# EasyEDA Pro project MSU-avionics.eprj

# Schematic Schematic1
Create Date: 2024-06-27; Page Name: P1; Project Name: MSU-avionics; Schematic Name: Schematic1; Update Date: 2024-06-28; Company: EasyEDA.com; Drawn: EasyEDA; Page Size: A4; Part Number: JLCPCB-002; Reviewed: EasyEDA; Version: V0.1
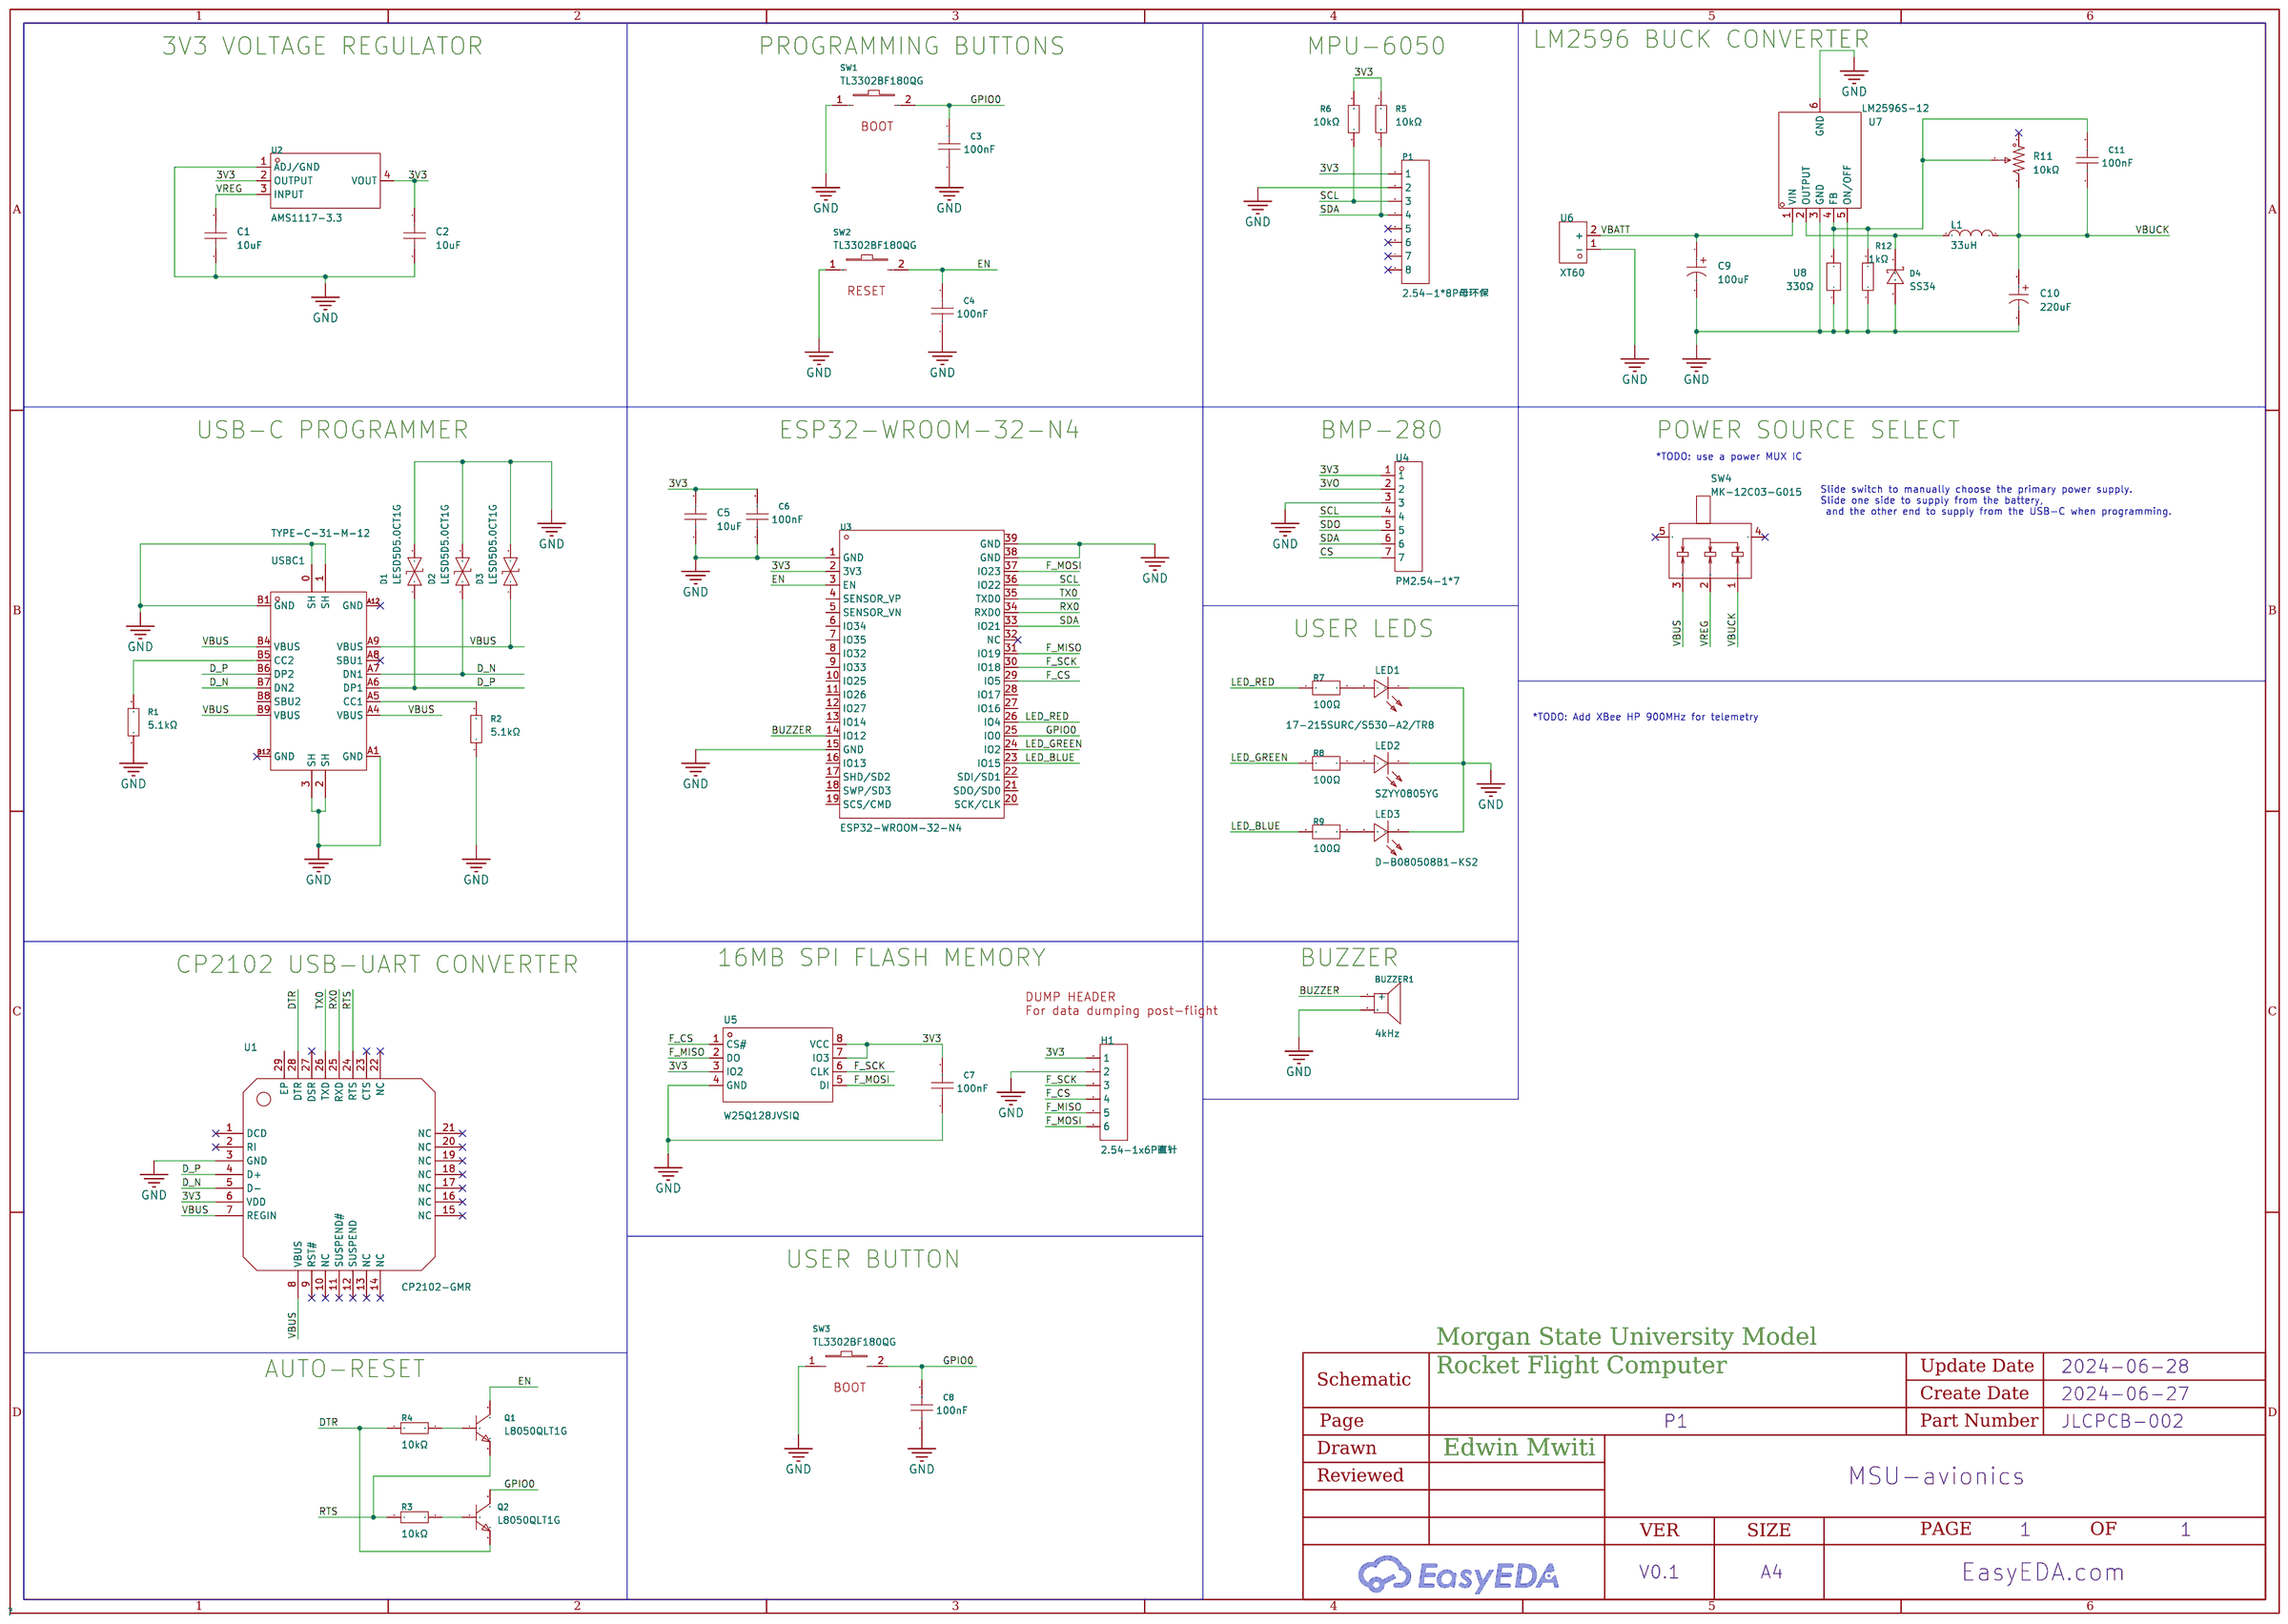
[diagram p0: schematic sheet]

## Parts
BUZZER1  4kHz  [BUZ-TH_BD14.0-P5.00-D0.7-FD]
C1  10uF  [C0805]
C2  10uF  [C0805]
C3  100nF  [C0805]
C4  100nF  [C0805]
C5  10uF  [C0805]
C6  100nF  [C0805]
C7  100nF  [C0805]
C8  100nF  [C0805]
C9  100uF  [CAP-SMD_BD6.3-L6.6-W6.6-LS7.2-FD]
C10  220uF  [CAP-SMD_BD10.0-L10.3-W10.3-FD]
C11  100nF  [C0805]
D1  LESD5D5.0CT1G  [SOD-523_L1.2-W0.8-LS1.6-BI]
D2  LESD5D5.0CT1G  [SOD-523_L1.2-W0.8-LS1.6-BI]
D3  LESD5D5.0CT1G  [SOD-523_L1.2-W0.8-LS1.6-BI]
D4  SS34  [SMA_L4.4-W2.6-LS5.0-RD]
H1  2.54-1x6P直针  [HDR-TH_6P-P2.54-V-M-1]
L1  33uH  [IND-SMD_L12.3-W12.3]
LED1  17-215SURC/S530-A2/TR8  [LED0805-RD_RED]
LED2  SZYY0805YG  [LED0805-R-RD_GREEN]
LED3  D-B080508B1-KS2  [LED0805-RD]
P1  2.54-1*8P母环保  [HDR-TH_8P-P2.54-V-F-1]
Q1  L8050QLT1G  [SOT-23-3_L2.9-W1.3-P1.90-LS2.4-BR]
Q2  L8050QLT1G  [SOT-23-3_L2.9-W1.3-P1.90-LS2.4-BR]
R1  5.1kΩ  [R0805]
R2  5.1kΩ  [R0805]
R3  10kΩ  [R0805]
R4  10kΩ  [R0805]
R5  10kΩ  [R0805]
R6  10kΩ  [R0805]
R7  100Ω  [R0603]
R8  100Ω  [R0603]
R9  100Ω  [R0603]
R11  10kΩ  [RES-ADJ-TH_3362P]
R12  1kΩ  [R0805]
SW1  TL3302BF180QG  [SW-SMD_L6.0-W3.5-LS10.2]
SW2  TL3302BF180QG  [SW-SMD_L6.0-W3.5-LS10.2]
SW3  TL3302BF180QG  [SW-SMD_L6.0-W3.5-LS10.2]
SW4  MK-12C03-G015  [SW-SMD_MK-12C03-G015]
U1  CP2102-GMR  [WQFN-28_L5.0-W5.0-P0.50-BL-EP3.2]
U2  AMS1117-3.3  [SOT-223-3_L6.5-W3.4-P2.30-LS7.0-BR]
U3  ESP32-WROOM-32-N4  [WIFIM-SMD_ESP32-WROOM-32-N4]
U4  PM2.54-1*7  [HDR-TH_7P-P2.54-V-F]
U5  W25Q128JVSIQ  [SOIC-8_L5.3-W5.3-P1.27-LS8.0-BL]
U6  XT60  [CONN-TH_XT60]
U7  LM2596S-12  [TO-263-5_L10.2-W8.9-P1.70-LS15.0-BR]
U8  330Ω  [R0805]
USBC1  TYPE-C-31-M-12  [USB-C_SMD-TYPE-C-31-M-12]

## Library data of the parts
BUZZER1 = PS1440P02BT: Oscillator Circuit:无源(外部驱动) Technology Type:压电式 Operating Voltage:30V Operating Voltage:30V Frequency:4kHz Sound Pressure Level (SPL):75dB@3V,10cm Diameter (φD):14mm Height:9.2mm Operating Temperature:-10℃~+70℃ Operating Temperature:-10℃~+70℃; LCSC Part Name: 14*8 压电式蜂鸣器; Supplier Part: C96060; Manufacturer: TDK; Supplier Footprint: 插件,D=14mm; JLCPCB Part Class: Extended Part; Datasheet: https://atta.szlcsc.com/upload/public/pdf/source/20180619/C96062_E8B34391C67E3A6436554BE49161222D.pdf; Supplier: LCSC; Oscillator Circuit: 无源(外部驱动); Technology Type: 压电式; Operating Voltage: 30V; Sound Pressure Level (SPL): 75dB@3V,10cm; Diameter (φD): 14mm; Height: 9.2mm; Operating Temperature: -10℃~+70℃
C1 C2 C5 = C0805X6S106K250NT: Capacitance: Voltage Rated: Temperature Coefficient:; LCSC Part Name: 10uF 25V; Supplier Part: C2835551; Manufacturer: SANYEAR(叁叶源); Supplier Footprint: 0805; JLCPCB Part Class: Extended Part; Datasheet: https://atta.szlcsc.com/upload/public/pdf/source/20211010/C2835566_14A0738C7D65B521DA1087F759FD87A4.pdf; Supplier: LCSC
C3 C4 C6-C8 C11 = CT41G-0805-2X1-50V-0.1μF-K(N): Capacitance: Tolerance:±10% Tolerance:±10% Voltage Rated: Temperature Coefficient:; LCSC Part Name: 100nF ±10% 50V; Supplier Part: C126469; Manufacturer: TORCH(火炬); Supplier Footprint: 0805; JLCPCB Part Class: Extended Part; Datasheet: https://atta.szlcsc.com/upload/public/pdf/source/20171225/C150708_15141883600121203188.pdf; Supplier: LCSC; Tolerance: ±10%
C9 = RX100UF50V90RV0105: Capacitance: Tolerance:±20% Tolerance:±20% Rated Voltage: φD: L: Lifetime @ Temp:2000hrs@105℃ Operating Temperature:-55℃~+105℃ Operating Temperature:-55℃~+105℃; LCSC Part Name: 100uF ±20% 50V; Supplier Part: C3445238; Manufacturer: KNSCHA(科尼盛); Supplier Footprint: SMD,D6.3xL7.7mm; JLCPCB Part Class: Extended Part; Datasheet: https://atta.szlcsc.com/upload/public/pdf/source/20220701/D79D7A555961B97CBF0C5B16B2483057.pdf; Supplier: LCSC; Tolerance: ±20%; Lifetime @ Temp: 2000hrs@105℃; Operating Temperature: -55℃~+105℃
C10 = FZ220UF50V90RV0126: Capacitance: Tolerance:±20% Tolerance:±20% Rated Voltage: Ripple Current:560mA@120Hz Equivalent Series Resistance(ESR):- φD: L: Lifetime @ Temp:5000hrs@105℃ Operating Temperature:-55℃~+105℃ Operating Temperature:-55℃~+105℃; LCSC Part Name: 220uF ±20% 50V; Supplier Part: C3148158; Manufacturer: KNSCHA(科尼盛); Supplier Footprint: SMD,D10xL10.5mm; JLCPCB Part Class: Extended Part; Datasheet: https://atta.szlcsc.com/upload/public/pdf/source/20220627/5502BE21D8B2EE11D1D4DBE23E443F81.pdf; Supplier: LCSC; Tolerance: ±20%; Ripple Current: 560mA@120Hz; Lifetime @ Temp: 5000hrs@105℃; Operating Temperature: -55℃~+105℃
D1-D3 = LESD5D5.0CT1G: polarity:Bi-Directional Reverse Stand-Off Voltage (Vrwm):5V Maximum Clamping Voltage:18.6V Peak Pulse Current (Ipp)@10/1000us:9.4A Breakdown Voltage:5.6V Type:ESD; LCSC Part Name: 双向ESD; Supplier Part: C383211; Manufacturer: LRC(乐山无线电); Supplier Footprint: SOD-523; JLCPCB Part Class: Extended Part; Datasheet: https://atta.szlcsc.com/upload/public/pdf/source/20190807/C383211_633DF4B4E2C161403226E5235FE33A1C.pdf; Supplier: LCSC; polarity: Bi-Directional; Reverse Stand-Off Voltage (Vrwm): 5V; Maximum Clamping Voltage: 18.6V; Peak Pulse Current (Ipp)@10/1000us: 9.4A; Breakdown Voltage: 5.6V; Type: ESD
D4 = SS34_C466502: Forward Voltage (Vf@If):550mV@3A Reverse Voltage (Vr):40V Average Rectified Current (Io):3A; LCSC Part Name: 电压:40V 电流:3A; Supplier Part: C466502; Manufacturer: High Diode(海德); Supplier Footprint: SMAG; JLCPCB Part Class: Extended Part; Datasheet: https://atta.szlcsc.com/upload/public/pdf/source/20191203/C466502_BA938B38AA17F4F6FFCBC3BE471D9AF8.pdf; Supplier: LCSC; Forward Voltage (Vf@If): 550mV@3A; Reverse Voltage (Vr): 40V; Average Rectified Current (Io): 3A
H1 = 2.54-1x6P直针: Pin Structure:1x6P Pitch:2.54mm Row Spacing:- Circluar Pins/Square Pins:Square Pins Mounting Type:Straight Number of Rows:Plugin Number of Pins:6P Current Rating (Max):3A Voltage Rating (Max):- Length of Mating Pin:- Insulation Height:- Contact Material:; LCSC Part Name: 间距:2.54mm 1x6P 直插 方针; Supplier Part: C37208; Manufacturer: BOOMELE(博穆精密); Supplier Footprint: 插件,P=2.54mm; JLCPCB Part Class: Extended Part; Supplier: LCSC; Pin Structure: 1x6P; Pitch: 2.54mm; Circluar Pins/Square Pins: Square Pins; Mounting Type: Straight; Number of Rows: Plugin; Number of Pins: 6P; Current Rating (Max): 3A; Operating Temperature Range: -40℃~+105℃; Color: Black
L1 = CYH127-33UH: Inductance: Tolerance:±20% Tolerance:±20% Rated Current: Saturation Current (Isat):- DC Resistance (DCR):64.8mΩ Q @ Freq:- Frequency - Self Resonant:- Ratings:; LCSC Part Name: 33uH ±20%; Supplier Part: C2929502; Manufacturer: SHOU HAN(首韩); Supplier Footprint: SMD,12.3x12.3mm; JLCPCB Part Class: Extended Part; Datasheet: https://atta.szlcsc.com/upload/public/pdf/source/20211213/324DC86371908DB0CEB38729D6079AD7.pdf; Supplier: LCSC; Tolerance: ±20%; DC Resistance (DCR): 64.8mΩ
LED1 = 17-215SURC/S530-A2/TR8: Emitted Color:Red; LCSC Part Name: 红灯; Supplier Part: C142306; Manufacturer: EVERLIGHT(亿光); Supplier Footprint: 0805; JLCPCB Part Class: Extended Part; Datasheet: https://atta.szlcsc.com/upload/public/pdf/source/20171110/C142306_15102792678801104249.pdf; Supplier: LCSC; Emitted Color: Red
LED2 = SZYY0805YG: Emitted Color:Green-yellow; LCSC Part Name: 普绿/黄绿; Supplier Part: C434435; Manufacturer: yongyu(永裕光电); Supplier Footprint: 0805; JLCPCB Part Class: Extended Part; Datasheet: https://atta.szlcsc.com/upload/public/pdf/source/20191204/C434435_1187404D4D35A500174CD35CE47973D5.pdf; Supplier: LCSC; Emitted Color: Green-yellow
LED3 = D-B080508B1-KS2: Emitted Color:Blue; LCSC Part Name: 蓝灯; Supplier Part: C108412; Manufacturer: ARKLED(方舟); Supplier Footprint: 0805; JLCPCB Part Class: Extended Part; Datasheet: https://atta.szlcsc.com/upload/public/pdf/source/20170505/1493957852061.pdf; Supplier: LCSC; Emitted Color: Blue
P1 = 2.54-1*8P母环保: Holes Structure:1x8P Pitch:2.54mm Row Spacing:- Mounting Type:Straight Number of Rows:Plugin Number of Holes:8P Insulation Height:- Contact Material:- Contact Plating:-; LCSC Part Name: 间距:2.54mm 1x8P 直插; Supplier Part: C27438; Manufacturer: BOOMELE(博穆精密); Supplier Footprint: 插件,P=2.54mm; JLCPCB Part Class: Extended Part; Datasheet: https://atta.szlcsc.com/upload/public/pdf/source/20231221/1CA800C6799ED97958773716FAA1BFFE.pdf; Supplier: LCSC; Holes Structure: 1x8P; Pitch: 2.54mm; Mounting Type: Straight; Number of Rows: Plugin; Number of Holes: 8P
Q1 Q2 = L8050QLT1G: Transistor Type: Collector Current (Ic): Collector-Emitter Breakdown Voltage (Vceo): Power Dissipation (Pd):; LCSC Part Name: 耐压:25V 电流:800mA NPN; Supplier Part: C49581; Manufacturer: LRC(乐山无线电); Supplier Footprint: SOT-23; JLCPCB Part Class: Extended Part; Datasheet: https://atta.szlcsc.com/upload/public/pdf/source/20150518/1457707314424.pdf; Supplier: LCSC
R1 R2 = RMC08055.1K1%N: Resistance: Tolerance:±1% Tolerance:±1% Power(Watts):; LCSC Part Name: 5.1kΩ ±1% 125mW; Supplier Part: C269748; Manufacturer: Tyohm(幸亚电阻); Supplier Footprint: 0805; JLCPCB Part Class: Extended Part; Datasheet: https://atta.szlcsc.com/upload/public/pdf/source/20190115/C325956_D27151D492FFB3C9AB4A6F14FE01F30A.pdf; Supplier: LCSC; Tolerance: ±1%
R3-R6 = RMC080510K1%N: Resistance: Tolerance:±1% Tolerance:±1% Power(Watts):; LCSC Part Name: 10kΩ ±1% 125mW; Supplier Part: C269742; Manufacturer: Tyohm(幸亚电阻); Supplier Footprint: 0805; JLCPCB Part Class: Extended Part; Datasheet: https://atta.szlcsc.com/upload/public/pdf/source/20190115/C325956_D27151D492FFB3C9AB4A6F14FE01F30A.pdf; Supplier: LCSC; Tolerance: ±1%
R7-R9 = TNPW0603100RBEEA: Type:Thin Film Resistor Resistance: Tolerance:±0.1% Tolerance:±0.1% Power(Watts): Temperature Coefficient:±25ppm/℃ Temperature Coefficient:±25ppm/℃ Operating Temperature Range:-55℃~+155℃ Operating Temperature Range:-55℃~+155℃; LCSC Part Name: 薄膜电阻 100Ω ±0.1% 100mW; Supplier Part: C844889; Manufacturer: VISHAY(威世); Supplier Footprint: 0603; JLCPCB Part Class: Extended Part; Datasheet: https://atta.szlcsc.com/upload/public/pdf/source/20231213/F986C3A7F51AE4B251C8687D5F24127F.pdf; Supplier: LCSC; Type: Thin Film Resistor; Tolerance: ±0.1%; Temperature Coefficient: ±25ppm/℃; Operating Temperature Range: -55℃~+155℃
R11 = 3362P-1-103_C118956: Resistance: Tolerance:±10% Tolerance:±10%; LCSC Part Name: 10kΩ ±10%; Supplier Part: C118956; Manufacturer: BOCHEN(博晨); Manufacturer Part: 3362P-1-103; Supplier Footprint: 插件; JLCPCB Part Class: Extended Part; Datasheet: https://atta.szlcsc.com/upload/public/pdf/source/20171114/C118956_15106326650691117445.pdf; Supplier: LCSC; Tolerance: ±10%
R12 = RMC08051K5%N: Resistance: Tolerance:±5% Tolerance:±5% Power(Watts):; LCSC Part Name: 1kΩ ±5% 125mW; Supplier Part: C269727; Manufacturer: Tyohm(幸亚电阻); Supplier Footprint: 0805; JLCPCB Part Class: Extended Part; Datasheet: https://atta.szlcsc.com/upload/public/pdf/source/20190115/C325956_D27151D492FFB3C9AB4A6F14FE01F30A.pdf; Supplier: LCSC; Tolerance: ±5%
SW1-SW3 = TL3302BF180QG: Circuit:SPST Actuator Style:Rectangle button Operating Force:180gf Mounting Style:Brick nogging Switch Length:6mm Switch Width:3.5mm Switch Height:5mm Strike Gundam:不带 Contact Current:50mA Voltage Rating (DC):12V Pin Style:Gull Wing Mechanical Life:40000次; LCSC Part Name: 6*3.5*5mm 立贴 轻触开关; Supplier Part: C2886915; Manufacturer: E-Switch; Supplier Footprint: SMD; JLCPCB Part Class: Extended Part; Datasheet: https://atta.szlcsc.com/upload/public/pdf/source/20220214/C24842334C846F14AED57E622A4202FD.pdf; Supplier: LCSC; Circuit: SPST; Actuator Style: Rectangle button; Operating Force: 180gf; Mounting Style: Brick nogging; Switch Length: 6mm; Switch Width: 3.5mm; Switch Height: 5mm; Strike Gundam: 不带; Contact Current: 50mA; Voltage Rating (DC): 12V; Pin Style: Gull Wing; Mechanical Life: 40000次
SW4 = MK-12C03-G015: Circuit:SPDT Actuator Style:Rectangular columnar Pin Style:SMDSplicing Switch Length:6.65mm Switch Width:2.75mm Switch Height:4.25mm Mounting Style:卧贴 Actuator Color:White Current Rating (DC):1A Voltage Rating (DC):6V Mechanical Life:1万次 Operating Tempera; LCSC Part Name: 新七脚小拨动开关 G1.5mm; Supplier Part: C2890358; Manufacturer: G-Switch(品赞); Supplier Footprint: SMD; JLCPCB Part Class: Extended Part; Datasheet: https://atta.szlcsc.com/upload/public/pdf/source/20240612/7D979AF25627BA0CE326E7EBF8EC90FA.pdf; Supplier: LCSC; Circuit: SPDT; Actuator Style: Rectangular columnar; Pin Style: SMDSplicing; Switch Length: 6.65mm; Switch Width: 2.75mm; Switch Height: 4.25mm; Mounting Style: 卧贴; Actuator Color: White; Current Rating (DC): 1A; Voltage Rating (DC): 6V; Mechanical Life: 1万次; Operating Temperature: -20℃~+70℃
U1 = CP2102-GMR: Applications Function:Transceiver Protocol: Supply Voltage:3V~3.6V Supply Voltage:3V~3.6V Data Rate:1Mbps; Supplier Part: C6568; Manufacturer: SKYWORKS/SILICON LABS(芯科); Supplier Footprint: WQFN-28-EP(5x5); JLCPCB Part Class: Extended Part; Datasheet: https://atta.szlcsc.com/upload/public/pdf/source/20170103/1483439882795.pdf; Supplier: LCSC; Applications Function: Transceiver; Supply Voltage: 3V~3.6V; Data Rate: 1Mbps
U2 = AMS1117-3.3_C18212698: Supplier Part: C18212698; Manufacturer: TECH PUBLIC(台舟); Supplier Footprint: SOT-223; Datasheet: https://atta.szlcsc.com/upload/public/pdf/source/20231024/2F46361C191D0B74404CBB3E85314756.pdf; Supplier: LCSC
U3 = ESP32-WROOM-32-N4: LCSC Part Name: WiFi+蓝牙4.2+双核CPU模块; Supplier Part: C82899; Manufacturer: ESPRESSIF(乐鑫); Supplier Footprint: SMD,18x25.5mm; JLCPCB Part Class: Extended Part; Datasheet: https://atta.szlcsc.com/upload/public/pdf/source/20210719/C82899_2D52724B6FAFABC419BCF308C5944296.pdf; Supplier: LCSC
U4 = PM2.54-1*7: Holes Structure:1x7P Pitch:2.54mm Number of Rows:Plugin Contact Plating:Gold; LCSC Part Name: 1x7P 间距:2.54mm; Supplier Part: C5371993; Manufacturer: ZHOURI(洲日); Supplier Footprint: 插件,P=2.54mm; JLCPCB Part Class: Extended Part; Datasheet: https://atta.szlcsc.com/upload/public/pdf/source/20220328/B91538B38D9D9FD0DC6AE4B2C8D04661.pdf; Supplier: LCSC; Holes Structure: 1x7P; Pitch: 2.54mm; Number of Rows: Plugin; Contact Plating: Gold
U5 = W25Q128JVSIQ: Interface Type:- Memory Size:128Mbit Clock Frequency (fc):- Supply Voltage:- Supply Voltage:- Supply Current (Read):- Supply Current (Program):- Supply Current (Erase):- Standby supply current:- Page Programming Time (Tpp):- Block Erase Time (tBE):- Data; LCSC Part Name: W25Q128JVSIQ 编带; Supplier Part: C97521; Manufacturer: WINBOND(华邦); Supplier Footprint: SOIC-8-208mil; JLCPCB Part Class: Basic Part; Datasheet: https://atta.szlcsc.com/upload/public/pdf/source/20170316/1489627409956.pdf; Supplier: LCSC; Memory Size: 128Mbit
U6 = XT60: Brand:艾迈斯 Model:XT60 Power:- Output:- Input:- Size:- Interface:- Type:- Colour:Yellow MaximumCurrent:- Type:香蕉头 RatedVoltage:- Type1:- NumberOfUSBHoles:- InterfaceType:公头 MetalMaterial:- InsulationMaterial:- RatedCurrent:- RecommendedWireGauge:- FlameReta; LCSC Part Name: AMASS(艾迈斯) XT60模型插头 3.5mm镀金香蕉头公头（电调端）XT60-M; Supplier Part: C98733; Manufacturer: AMASS(艾迈斯); JLCPCB Part Class: Extended Part; Datasheet: https://atta.szlcsc.com/upload/public/pdf/source/20170606/1496716524919.pdf; Supplier: LCSC; Brand: 艾迈斯; Type: 香蕉头; Colour: Yellow; InterfaceType: 公头; specifications: 3.5mm
U7 = LM2596S-12_C5349986: Function:Step-down type Output Type:Adjustable Input Voltage:40V Input Voltage:40V Output Voltage:12V Output Voltage:12V Output Current (Max):3.5A Operating Temperature:-40℃~+125℃ Operating Temperature:-40℃~+125℃ Number of Outputs:1 Switch tube (built-in/; Supplier Part: C5349986; Manufacturer: HXY MOSFET(华轩阳电子); Supplier Footprint: TO-263-5L; JLCPCB Part Class: Extended Part; Datasheet: https://atta.szlcsc.com/upload/public/pdf/source/20230111/199BC35A7A4D0647B85E7DE5CE9FEA7F.pdf; Supplier: LCSC; Function: Step-down type; Output Type: Adjustable; Input Voltage: 40V; Output Voltage: 12V; Output Current (Max): 3.5A; Operating Temperature: -40℃~+125℃; Number of Outputs: 1; Switch tube (built-in/external): 内置
U8 = CRCW0805330RFKEAHP: Type:Thick Film Resistors Resistance: Tolerance:±1% Tolerance:±1% Power(Watts): Overload Voltage (Max): Temperature Coefficient:±100ppm/℃ Temperature Coefficient:±100ppm/℃ Operating Temperature Range:-55℃~+155℃ Operating Temperature Range:-55℃~+155℃; LCSC Part Name: 厚膜电阻 330Ω ±1% 500mW; Supplier Part: C313892; Manufacturer: VISHAY(威世); Supplier Footprint: 0805; JLCPCB Part Class: Extended Part; Datasheet: https://atta.szlcsc.com/upload/public/pdf/source/20210128/C313329_30EDDB0DCE34428579C0BE4C994F6084.pdf; Supplier: LCSC; Type: Thick Film Resistors; Tolerance: ±1%; Temperature Coefficient: ±100ppm/℃; Operating Temperature Range: -55℃~+155℃
USBC1 = TYPE-C-31-M-12: Connector Type:Type-C Standard:- Gender:Female Number of Ports:1 Number of Contacts:16P Mounting Style:- Current Rating - Power (Max):5A Contact Material:- Contact Plating:- Operating Temperature Range:- Operating Temperature Range:- Soldering Temperature; LCSC Part Name: Type-C 母; Supplier Part: C165948; Manufacturer: 韩国韩荣; Supplier Footprint: SMD; JLCPCB Part Class: Extended Part; Datasheet: https://atta.szlcsc.com/upload/public/pdf/source/20220525/466408E853115E789EDB0DDC29077C05.pdf; Supplier: LCSC; Connector Type: Type-C; Gender: Female; Number of Ports: 1; Number of Contacts: 16P; Current Rating - Power (Max): 5A

## Nets
3V3: C2.2 C5.2 C6.2 C7.2 H1.1 P1.1 R5.2 R6.2 U1.6(VDD) U2.2(OUTPUT) U2.4(VOUT) U3.2(3V3) U4.1 U5.3(IO2) U5.7(IO3) U5.8(VCC)
3VO: U4.2
GND: BUZZER1.2 C1.1 C2.1 C3.1 C4.1 C5.1 C6.1 C7.1 C8.1 C9.2 C10.2 D1.2 D2.2 D3.2 D4.2 H1.2 LED1.1(K) LED2.2(-) LED3.1(K) P1.2 R1.1 R2.1 R12.1 SW1.1 SW2.1 SW3.1 U1.3(GND) U2.1(ADJ/GND) U3.1(GND) U3.15(GND) U3.38(GND) U3.39(GND) U4.3 U5.4(GND) U6.1(-) U7.3(GND) U7.5(ON/OFF) U7.6(GND) U8.1 USBC1.0(SH) USBC1.1(SH) USBC1.2(SH) USBC1.3(SH) USBC1.A1(GND) USBC1.B1(GND)
VBATT: C9.1 U6.2(+) U7.1(VIN)
VBUS: D3.1 SW4.3 U1.7(REGIN) U1.8(VBUS) USBC1.A4(VBUS) USBC1.A9(VBUS) USBC1.B4(VBUS) USBC1.B9(VBUS)
BUZZER: BUZZER1.1(+) U3.14(IO12)
CS: U4.7
D_N: D2.1 U1.5(D-) USBC1.A7(DN1) USBC1.B7(DN2)
D_P: D1.1 U1.4(D+) USBC1.A6(DP1) USBC1.B6(DP2)
DTR: Q2.2(E) R4.1 U1.28(DTR)
EN: C4.2 Q1.3(C) SW2.2 U3.3(EN)
F_CS: H1.4 U3.29(IO5) U5.1(CS#)
F_MISO: H1.5 U3.31(IO19) U5.2(DO)
F_MOSI: H1.6 U3.37(IO23) U5.5(DI)
F_SCK: H1.3 U3.30(IO18) U5.6(CLK)
GPIO0: C3.2 C8.2 Q2.3(C) SW1.2 SW3.2 U3.25(IO0)
LED_BLUE: R9.1 U3.23(IO15)
LED_GREEN: R8.1 U3.24(IO2)
LED_RED: R7.1 U3.26(IO4)
RTS: Q1.2(E) R3.1 U1.24(RTS)
RX0: U1.25(RXD) U3.34(RXD0)
SCL: P1.3 R6.1 U3.36(IO22) U4.4
SDA: P1.4 R5.1 U3.33(IO21) U4.6
SDO: U4.5
TX0: U1.26(TXD) U3.35(TXD0)
VBUCK: C10.1 C11.1 L1.2 R11.3 SW4.1
VREG: C1.2 SW4.2 U2.3(INPUT)
$1N895: R2.2 USBC1.A5(CC1)
$1N1043: R1.2 USBC1.B5(CC2)
$1N2304: Q1.1(B) R4.2
$1N2344: Q2.1(B) R3.2
$1N5171: LED1.2(A) R7.2
$1N5209: LED2.1(+) R8.2
$1N5283: LED3.2(A) R9.2
$1N6381: D4.1 L1.1 U7.2(OUTPUT)
$1N7006: C11.2 R11.2 R12.2 U7.4(FB) U8.2

Not connected (* = marked no-connect by the designer): P1 5* 6* 7* 8*; R11 1*; SW4 4* 5*; U1 1(DCD)* 2(RI)* 9(RST#)* 10(NC)* 11(SUSPEND#)* 12(SUSPEND)* 13(NC)* 14(NC)* 15(NC)* 16(NC)* 17(NC)* 18(NC)* 19(NC)* 20(NC)* 21(NC)* 22(NC)* 23(CTS)* 27(DSR)* 29(EP); U3 4(SENSOR_VP) 5(SENSOR_VN) 6(IO34) 7(IO35) 8(IO32) 9(IO33) 10(IO25) 11(IO26) 12(IO27) 13(IO14) 16(IO13) 17(SHD/SD2) 18(SWP/SD3) 19(SCS/CMD) 20(SCK/CLK) 21(SDO/SD0) 22(SDI/SD1) 27(IO16) 28(IO17) 32(NC)*; USBC1 A8(SBU1)* A12(GND)* B8(SBU2) B12(GND)*

## Notes on the sheet
- 3V3 VOLTAGE REGULATOR
- PROGRAMMING BUTTONS
- MPU-6050
- LM2596 BUCK CONVERTER
- BOOT
- RESET
- USB-C PROGRAMMER
- ESP32-WROOM-32-N4
- BMP-280
- POWER SOURCE SELECT
- *TODO: use a power MUX IC
- Slide switch to manually choose the primary power supply.
  Slide one side to supply from the battery,
   and the other end to supply from the USB-C when programming.
- USER LEDS
- *TODO: Add XBee HP 900MHz for telemetry
- 16MB SPI FLASH MEMORY
- BUZZER
- CP2102 USB-UART CONVERTER
- DUMP HEADER
  For data dumping post-flight
- USER BUTTON
- AUTO-RESET
- Morgan State University Model
  Rocket Flight Computer
- BOOT
- Edwin Mwiti

# Board PCB1
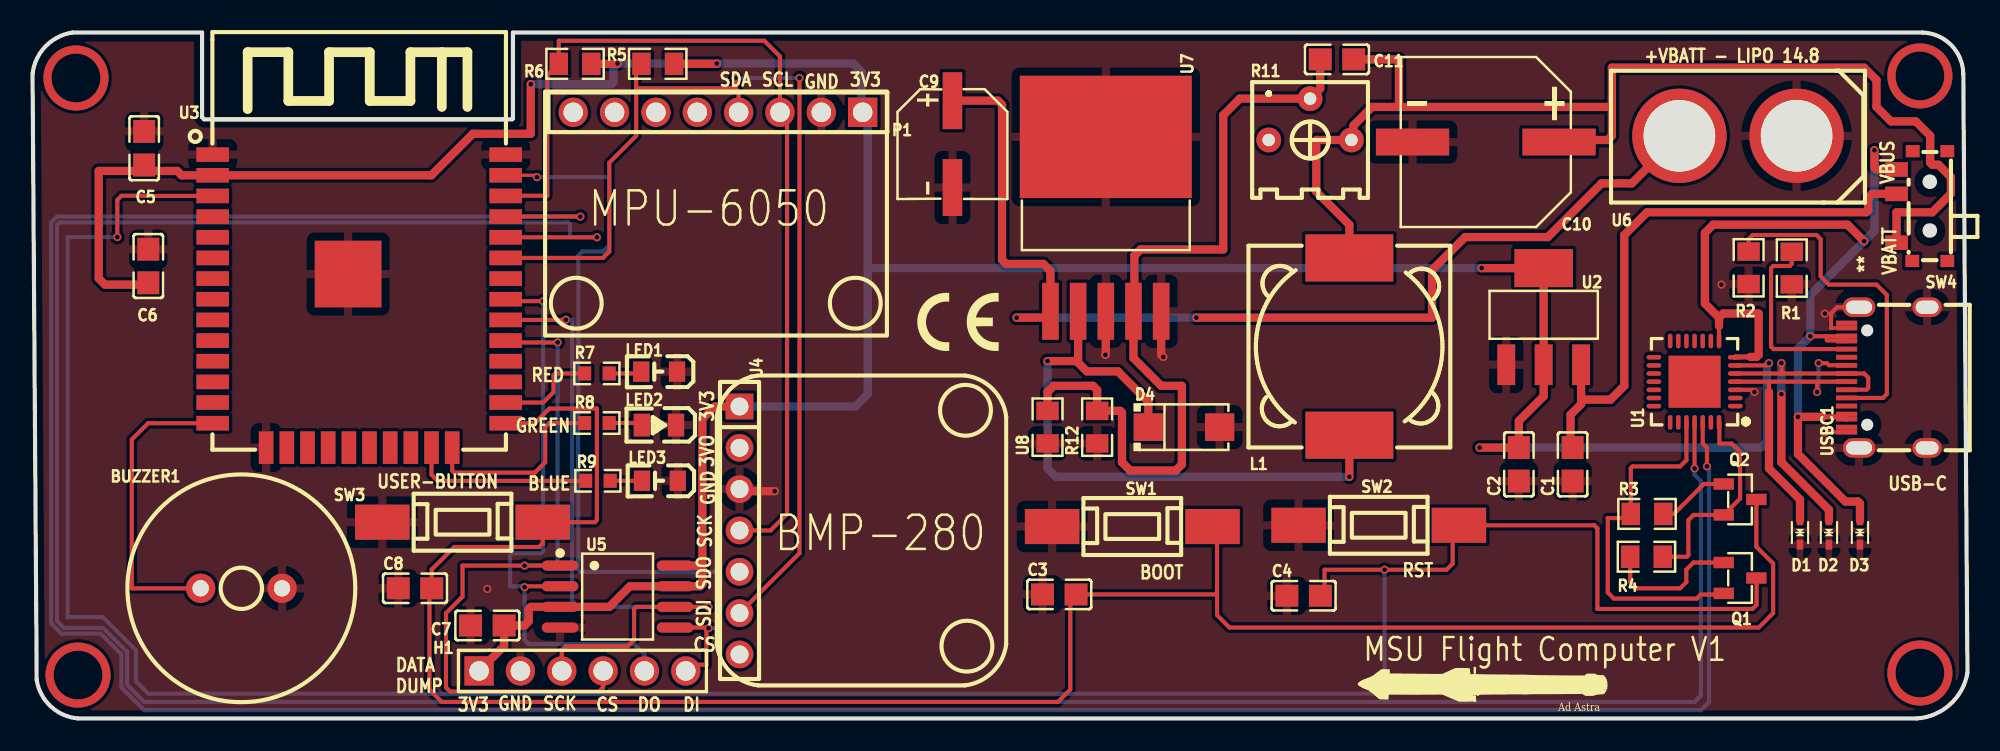
[diagram p1: board, top side]
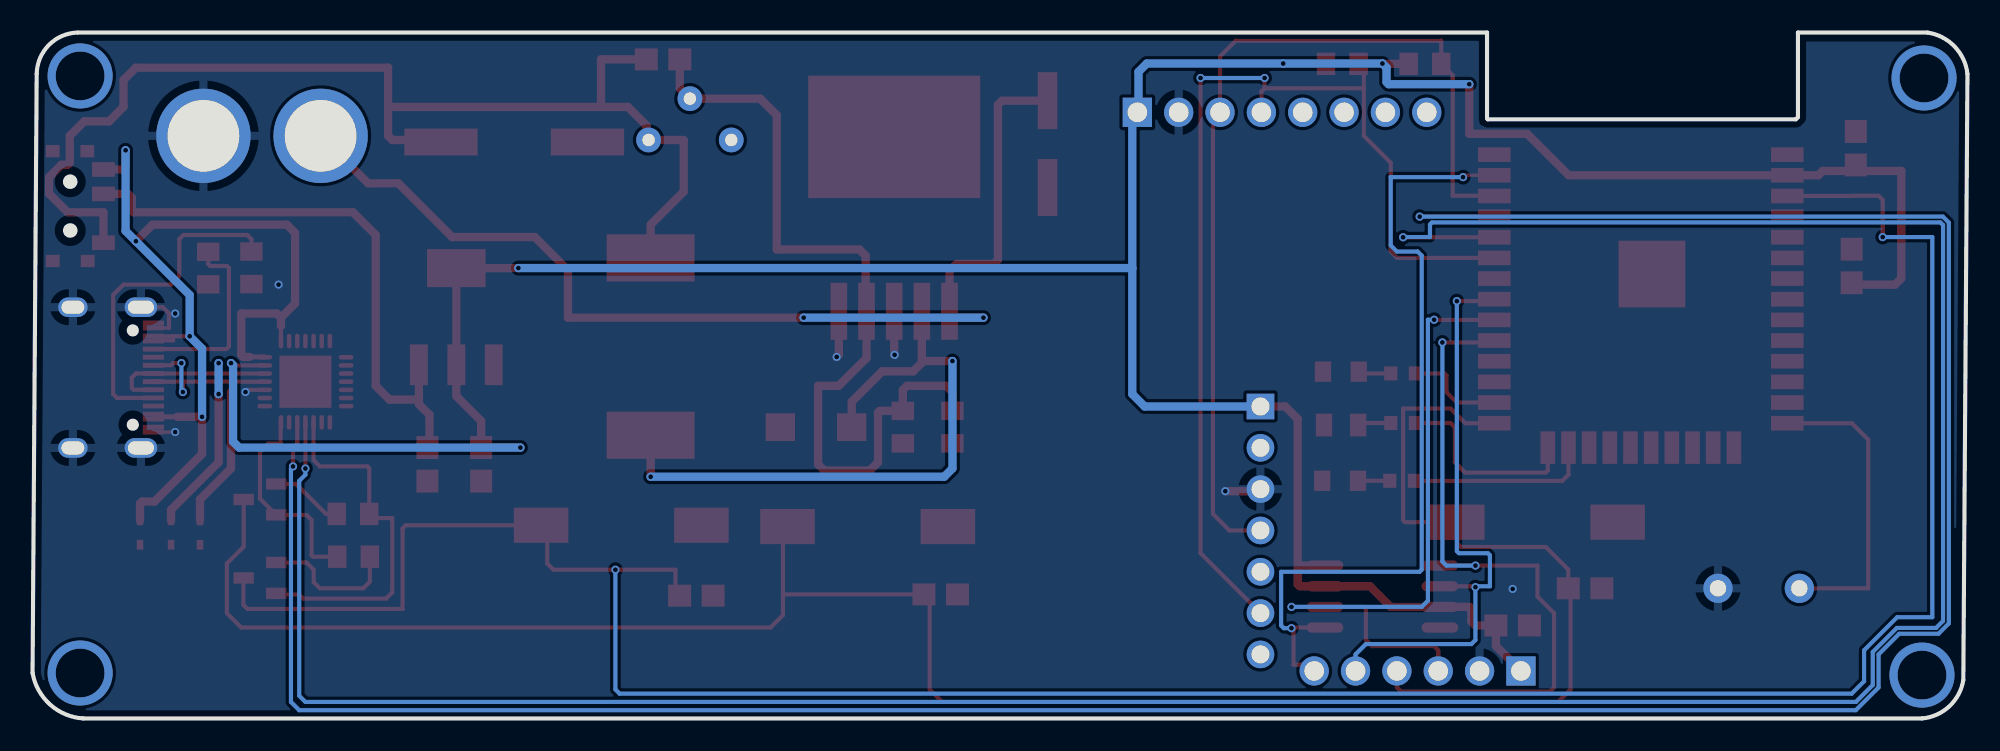
[diagram p2: board, bottom side, seen from below]

Outline 118.87 x 42.16 mm; copper layers: Top Layer, Bottom Layer. Coordinates in mm from the lower left corner of the outline.
Outline path: 0,39.62 0.25,2.37 arc(1.11,0.75) 2.79,0 115.76,0 arc(117.8,0.86) 118.87,2.79 118.62,39.62 arc(117.87,41.4) 116.11,42.16 29.51,42.16 29.51,36.88 29.46,36.83 10.54,36.83 10.41,36.96 10.41,42.16 2.46,42.16 arc(0.8,41.31) 0,39.62
Stack: Top Layer 0.035mm / Dielectric1 1.51mm FR4 er 4.5 / Bottom Layer 0.035mm

## Design rules (mm)
template: Custom Config
spacing copperThickness1oz (default): track to track 0.102, other pairs 0 to 0.3
spacing copperThickness2oz: track to track 0.203, other pairs 0.152 to 0.3
track width copperThickness1oz (default): min 0.127, default 0.254, max 2.54
track width copperThickness2oz: min 0.203, default 0.254, max 2.54
track width power: min 0.127, default 0.5, max 0.7
differential pair differentialPair (default): width min 0.127, default 0.254, max 2.54; gap min 0.152, default 0.152
via viaSize (default): diameter min 0.5, default 0.61, max 10; hole min 0.3, default 0.305, max 6.3
net VBUS uses power
net 3V3 uses power
net VREG uses power
net 3VO uses power
net VBATT uses power
net $1N7006 uses power
net $1N6381 uses power
net VBUCK uses power

## Placement (name value [footprint] x y rotation side)
BUZZER1  4kHz  [BUZ-TH_BD14.0-P5.00-D0.7-FD]  12.83 8 0 top
C1  10uF  [C0805]  94.61 15.62 90 top
C2  10uF  [C0805]  91.31 15.62 90 top
C3  100nF  [C0805]  63.08 7.63 0 top
C4  100nF  [C0805]  78.09 7.55 0 top
C5  10uF  [C0805]  6.86 35.05 270 top
C6  100nF  [C0805]  7.11 27.81 270 top
C7  100nF  [C0805]  27.94 5.71 0 top
C8  100nF  [C0805]  23.49 8 0 top
C9  100uF  [CAP-SMD_BD6.3-L6.6-W6.6-LS7.2-FD]  56.52 35.31 270 top
C10  220uF  [CAP-SMD_BD10.0-L10.3-W10.3-FD]  89.28 35.43 180 top
C11  100nF  [C0805]  80.14 40.51 180 top
D1  LESD5D5.0CT1G  [SOD-523_L1.2-W0.8-LS1.6-BI]  108.58 11.43 270 top
D2  LESD5D5.0CT1G  [SOD-523_L1.2-W0.8-LS1.6-BI]  110.36 11.43 270 top
D3  LESD5D5.0CT1G  [SOD-523_L1.2-W0.8-LS1.6-BI]  112.27 11.43 270 top
D4  SS34  [SMA_L4.4-W2.6-LS5.0-RD]  70.74 17.91 0 top
H1  2.54-1x6P直针  [HDR-TH_6P-P2.54-V-M-1]  33.78 2.92 0 top
L1  33uH  [IND-SMD_L12.3-W12.3]  80.9 22.86 90 top
LED1  17-215SURC/S530-A2/TR8  [LED0805-RD_RED]  38.49 21.32 180 top
LED2  SZYY0805YG  [LED0805-R-RD_GREEN]  38.48 18.03 180 top
LED3  D-B080508B1-KS2  [LED0805-RD]  38.54 14.61 180 top
P1  2.54-1*8P母环保  [HDR-TH_8P-P2.54-V-F-1]  42.11 37.26 180 top
Q1  L8050QLT1G  [SOT-23-3_L2.9-W1.3-P1.90-LS2.4-BR]  104.9 8.64 180 top
Q2  L8050QLT1G  [SOT-23-3_L2.9-W1.3-P1.90-LS2.4-BR]  104.9 13.46 180 top
R1  5.1kΩ  [R0805]  108.08 27.69 90 top
R2  5.1kΩ  [R0805]  105.43 27.7 90 top
R3  10kΩ  [R0805]  99.19 12.57 0 top
R4  10kΩ  [R0805]  99.15 9.94 180 top
R5  10kΩ  [R0805]  38.41 40.24 0 top
R6  10kΩ  [R0805]  33.33 40.24 0 top
R7  100Ω  [R0603]  34.67 21.21 0 top
R8  100Ω  [R0603]  34.67 18.16 0 top
R9  100Ω  [R0603]  34.73 14.61 0 top
R11  10kΩ  [RES-ADJ-TH_3362P]  78.49 36.83 0 top
R12  1kΩ  [R0805]  65.4 17.91 90 top
SW1  TL3302BF180QG  [SW-SMD_L6.0-W3.5-LS10.2]  67.56 11.8 0 top
SW2  TL3302BF180QG  [SW-SMD_L6.0-W3.5-LS10.2]  82.7 11.88 0 top
SW3  TL3302BF180QG  [SW-SMD_L6.0-W3.5-LS10.2]  26.42 12.06 0 top
SW4  MK-12C03-G015  [SW-SMD_MK-12C03-G015]  116.07 31.5 90 top
U1  CP2102-GMR  [WQFN-28_L5.0-W5.0-P0.50-BL-EP3.2]  102.11 20.7 90 top
U2  AMS1117-3.3  [SOT-223-3_L6.5-W3.4-P2.30-LS7.0-BR]  92.84 24.71 270 top
U3  ESP32-WROOM-32-N4  [WIFIM-SMD_ESP32-WROOM-32-N4]  20.07 25.65 0 top
U4  PM2.54-1*7  [HDR-TH_7P-P2.54-V-F]  43.43 11.56 270 top
U5  W25Q128JVSIQ  [SOIC-8_L5.3-W5.3-P1.27-LS8.0-BL]  35.94 7.49 270 top
U6  XT60  [CONN-TH_XT60]  104.77 35.81 180 top
U7  LM2596S-12  [TO-263-5_L10.2-W8.9-P1.70-LS15.0-BR]  65.94 30.39 270 top
U8  330Ω  [R0805]  62.36 17.91 90 top
USBC1  TYPE-C-31-M-12  [USB-C_SMD-TYPE-C-31-M-12]  113.92 20.95 90 top

## Footprints (pads in the part's own frame, mm; a bottom-side part is the same pattern mirrored in y, then rotated)
BUZ-TH_BD14.0-P5.00-D0.7-FD
  round 1.8 hole 1: 1(-2.5,0) 2(2.5,0)
C0805
  rect 1.41x1.35 smd: 1(-1.03,0) 2(1.03,0)
CAP-SMD_BD6.3-L6.6-W6.6-LS7.2-FD
  rect 3.5x1.2 smd: 1(-2.67,0) 2(2.67,0)
CAP-SMD_BD10.0-L10.3-W10.3-FD
  rect 4.5x1.65 smd: 1(-4.5,0) 2(4.5,0)
CONN-TH_XT60
  round 5.8 hole 4.4: 1(-3.6,0) 2(3.6,0)
HDR-TH_6P-P2.54-V-M-1
  rect 1.8x1.8 hole 1.2: 1(-6.35,0)
  round 1.8 hole 1.2: 2(-3.81,0) 3(-1.27,0) 4(1.27,0) 5(3.81,0) 6(6.35,0)
HDR-TH_7P-P2.54-V-F
  rect 1.575x1.7 hole 1.1: 1(-7.62,0)
  round 1.7 hole 1.1: 2(-5.08,0) 3(-2.54,0) 4(0,0) 5(2.54,0) 6(5.08,0) 7(7.62,0)
HDR-TH_8P-P2.54-V-F-1
  rect 1.8x1.8 hole 1.2: 1(-8.89,0)
  round 1.8 hole 1.2: 2(-6.35,0) 3(-3.81,0) 4(-1.27,0) 5(1.27,0) 6(3.81,0) 7(6.35,0) 8(8.89,0)
IND-SMD_L12.3-W12.3
  rect 2.9x5.4 smd: 1(-5.45,0) 2(5.45,0)
LED0805-R-RD_GREEN
  rect 1x1.399 smd: 1(1.05,0) 2(-1.05,0)
LED0805-RD
  rect 1x1.25 smd: 1(-1.1,0) 2(1.1,0)
LED0805-RD_RED
  rect 1x1.25 smd: 1(-1.1,0) 2(1.1,0)
R0603
  rect 0.806x0.864 smd: 1(-0.753,0) 2(0.753,0)
R0805
  rect 1.133x1.377 smd: 1(-1,0) 2(1,0)
RES-ADJ-TH_3362P
  round 1.524 hole 0.762: 1(-2.54,-1.27) 2(0,1.27) 3(2.54,-1.27)
SMA_L4.4-W2.6-LS5.0-RD
  rect 1.8x1.7 smd: 1(-2.192,0) 2(2.192,0)
SOD-523_L1.2-W0.8-LS1.6-BI
  rect 0.6x0.4 smd: 1(-0.75,0) 2(0.75,0)
SOIC-8_L5.3-W5.3-P1.27-LS8.0-BL
  oval 0.63x2.25 smd: 1(-1.905,-3.53) 2(-0.635,-3.53) 3(0.635,-3.53) 4(1.905,-3.53) 5(1.905,3.53) 6(0.635,3.53) 7(-0.635,3.53) 8(-1.905,3.53)
SOT-23-3_L2.9-W1.3-P1.90-LS2.4-BR
  rect 1.25x0.7 smd: 1(1,-0.95) 2(1,0.95) 3(-1,0)
SOT-223-3_L6.5-W3.4-P2.30-LS7.0-BR
  rect 2.5x1.1 smd: 1(2.97,-2.3) 2(2.97,0) 3(2.97,2.3)
  rect 2.34x3.6 smd: 4(-2.97,0)
SW-SMD_L6.0-W3.5-LS10.2
  rect 3.35x2.16 smd: 1(-4.925,0) 2(4.925,0)
SW-SMD_MK-12C03-G015
  rect 0.9x1.4 smd: 1(-2.251,1.558) 2(0.75,1.558) 3(2.25,1.558)
  rect 0.75x0.85 smd: 4(-3.375,0.592) 5(-3.375,-1.558) 6(3.375,0.567) 7(3.375,-1.558)
TO-263-5_L10.2-W8.9-P1.70-LS15.0-BR
  rect 3.5x1.02 smd: 1(5.36,-3.4) 2(5.36,-1.7) 3(5.36,0) 4(5.36,1.7) 5(5.36,3.4)
  rect 7.521x10.566 smd: 6(-5.36,0)
USB-C_SMD-TYPE-C-31-M-12
  oval 1.2x2 hole 0.8x1.6: 0(-4.325,1.706) 1(4.325,1.706)
  oval 1.2x1.8 hole 0.8x1.4: 2(4.325,-2.474) 3(-4.325,-2.474)
  rect 0.3x1.3 smd: A1(-3.35,2.474) A4(-2.55,2.474) A5(-1.25,2.474) A6(-0.25,2.474) A7(0.25,2.474) A8(1.25,2.474) A9(2.55,2.474) A12(3.35,2.474) B1(3.05,2.474) B4(2.25,2.474) B5(1.75,2.474) B6(0.75,2.474) B7(-0.75,2.474) B8(-1.75,2.474) B9(-2.25,2.474) B12(-3.05,2.474)
WIFIM-SMD_ESP32-WROOM-32-N4
  rect 2x0.9 smd: 1(-9,9.005) 2(-9,7.735) 3(-9,6.465) 4(-9,5.195) 5(-9,3.925) 6(-9,2.655) 7(-9,1.385) 8(-9,0.115) 9(-9,-1.155) 10(-9,-2.425) 11(-9,-3.695) 12(-9,-4.965) 13(-9,-6.235) 14(-9,-7.505) 25(9,-7.505) 26(9,-6.235) 27(9,-4.965) 28(9,-3.695) 29(9,-2.425) 30(9,-1.155) 31(9,0.115) 32(9,1.385) 33(9,2.655) 34(9,3.925) 35(9,5.195) 36(9,6.465) 37(9,7.735) 38(9,9.005)
  rect 0.9x2 smd: 15(-5.715,-9.005) 16(-4.445,-9.005) 17(-3.175,-9.005) 18(-1.905,-9.005) 19(-0.635,-9.005) 20(0.635,-9.005) 21(1.905,-9.005) 22(3.175,-9.005) 23(4.445,-9.005) 24(5.715,-9.005)
  rect 4.1x4.1 smd: 39(-0.68,1.665)
WQFN-28_L5.0-W5.0-P0.50-BL-EP3.2
  oval 0.28x0.9 smd: 1(-1.502,-2.5) 2(-1.001,-2.5) 3(-0.5,-2.5) 4(0,-2.5) 5(0.5,-2.5) 6(1,-2.5) 7(1.501,-2.5) 15(1.501,2.5) 16(1,2.5) 17(0.5,2.5) 18(0,2.5) 19(-0.5,2.5) 20(-1.001,2.5) 21(-1.502,2.5)
  oval 0.9x0.28 smd: 8(2.5,-1.502) 9(2.5,-1.001) 10(2.5,-0.5) 11(2.5,0) 12(2.5,0.5) 13(2.5,1) 14(2.5,1.501) 22(-2.5,1.501) 23(-2.5,1) 24(-2.5,0.5) 25(-2.5,0) 26(-2.5,-0.5) 27(-2.5,-1.001) 28(-2.5,-1.502)
  rect 3.2x3.2 smd: 29(0,0)

## Nets
As in the schematic.

Pads without a net: P1 5 6 7 8; R11 1; SW4 4 5 6 7; U1 1 2 9 10 11 12 13 14 15 16 17 18 19 20 21 22 23 27 29; U3 4 5 6 7 8 9 10 11 12 13 16 17 18 19 20 21 22 27 28 32; USBC1 A8 A12 B8 B12

## Via types
v1: diameter 4, hole 3, Top Layer to Bottom Layer, 4 vias
v2: diameter 0.5, hole 0.3, Top Layer to Bottom Layer, 42 vias

## Routing (per net, layer and track width the routed paths; a pad name or vN(x,y) marks a point on that pad's centre or on a via; arc(x,y) is an arc through that point)
3V3: length 207
  Top Layer w0.254: v2(106.68,21.84) 106.54,21.7 U1.6
  Top Layer w0.508: 7.11,26.78 7,26.67 4.44,26.67 4.06,27.05 4.06,33.66 6.49,33.66 C5.2 7.22,33.66 8.89,33.66 9.16,33.39 U3.2 24.5,33.39 27.05,35.94 30.61,35.94 v2(30.61,38.99) ; 41.15,9.14 41.15,18.41 41.91,19.18 U4.1 ; 41.15,9.14 41.15,8.25 41.02,8.13 U5.7 36.7,8.13 35.43,6.86 U5.3 30.61,6.86 30.48,6.73 30.48,5.97 30.23,5.71 C7.2 28.97,4.46 H1.1 ; 41.15,9.14 40.89,9.4 U5.8 ; v2(88.9,16.65) C2.2 91.31,18.29 92.84,19.81 U2.2 U2.4 89.03,27.68 v2(89.03,27.69) ; R6.2 35.92,40.24 v2(35.94,40.26) ; R5.2 42.02,40.24 v2(42.04,40.26)
  Bottom Layer w0.508: U4.1 50.55,19.18 51.31,19.94 51.31,27.69 ; 51.31,27.69 51.31,36.95 P1.1 50.93,37.33 50.93,39.75 50.42,40.26 v2(42.04,40.26) v2(35.94,40.26) 35.69,40 35.69,39.12 35.56,38.99 v2(30.61,38.99) ; 51.31,27.69 v2(89.03,27.69) ; v2(88.9,16.65) 106.19,16.65 106.55,17.02 106.55,21.72 v2(106.68,21.84)
GND: length 14.1
  Top Layer w0.203: USBC1.B1 110.56,24 ; 111.45,17.6 v2(110.11,17.6)
  Top Layer w0.254: v2(105.79,20.07) 105.66,20.2 U1.3 ; 110.56,24 110.49,24 110.49,24.9 110.87,25.28 USBC1.1
  Top Layer w0.508: v2(65.91,22.35) 65.94,22.38 U7.3 ; U4.3 43.56,13.97 v2(45.59,13.97) ; v2(69.47,22.22) 69.34,22.36 U7.5
  vias: v2(27.94,7.96) v2(103.76,26.67) v2(110.11,24.89)
VBATT: length 67.8
  Top Layer w0.508: v2(71.5,24.64) 85.98,24.64 85.98,27.56 88.01,29.59 93.09,29.59 96.39,32.89 98.25,32.89 U6.2 ; v2(60.45,24.64) 62.36,24.64 62.54,24.82 U7.1 62.54,27.51 62.1,27.94 59.82,27.94 59.56,28.19 59.56,37.72 59.31,37.98 C9.1
  Bottom Layer w0.508: v2(71.5,24.64) v2(60.45,24.64)
VBUS: length 59.9
  Top Layer w0.254: USBC1.A9 111.43,23.49 110.24,23.49 ; 110.24,23.49 110.24,23.24 111.41,23.24 USBC1.B4 ; 110.24,23.49 v2(109.22,23.49) ; U1.8 103.61,24.13
  Top Layer w0.305: 105.54,22.22 104.63,22.22 U1.7 ; 109.98,18.54 111.31,18.54 USBC1.A4
  Top Layer w0.508: 109.98,18.54 v2(108.46,18.54) 108.46,16.26 111.38,13.33 112.14,13.33 112.27,13.21 D3.1 ; v2(113.16,34.92) 113.16,33.87 113.28,33.75 SW4.3 ; 105.54,22.22 105.92,22.22 106.05,22.35 106.05,24.89 103.86,24.89 103.61,24.64 ; v2(112.52,29.34) 111.51,30.35 103.25,30.35 102.74,29.84 102.74,25.5 103.61,24.64 ; 103.61,24.13 103.61,24.64
  Bottom Layer w0.508: v2(108.46,18.54) 108.46,22.73 v2(109.22,23.49) 109.22,26.03 v2(112.52,29.34) 113.16,29.97 v2(113.16,34.92)
(no net):
  vias: v1(2.67,39.37) v1(2.79,2.67) v1(115.95,39.5) v1(115.95,2.79)
BUZZER: length 18.8
  Top Layer w0.254: BUZZER1.1 6.1,8 6.1,17.14 7.1,18.15 U3.14
D_N: length 21.8
  Top Layer w0.254: v2(107.44,21.84) 107.46,21.83 107.46,21.2 ; U1.5 107.46,21.2 ; 107.46,21.2 111.44,21.2 USBC1.A7 112.53,21.2 112.78,20.95 112.78,20.32 112.66,20.2 USBC1.B7
  Top Layer w0.508: D2.1 110.36,12.83 107.44,15.75 v2(107.44,19.94)
  Bottom Layer w0.508: v2(107.44,19.94) v2(107.44,21.84)
D_P: length 20.4
  Top Layer w0.254: 106.68,20.07 106.68,20.7 106.68,20.7 ; 106.68,20.7 109.64,20.7 ; 106.68,20.7 U1.4 ; 109.64,20.7 111.44,20.7 USBC1.A6 ; 109.64,20.7 v2(109.64,20.07) ; USBC1.B6 111.43,21.72 110.36,21.72 110.24,21.84 v2(109.73,21.84)
  Top Layer w0.508: D1.1 108.58,13.46 106.68,15.37 106.68,20.07
  Bottom Layer w0.254: v2(109.64,20.07) 109.73,20.16 v2(109.73,21.84)
DTR: length 13.2
  Top Layer w0.254: R4.1 101.64,9.94 101.73,10.03 101.73,12.19 102.05,12.51 Q2.2 104.9,13.51 104.9,16.38 104.39,16.89 103.63,16.89 103.63,18.18 U1.28
EN: length 163.4
  Top Layer w0.254: Q1.3 105.92,8.62 105.92,6.98 105.66,6.73 96.14,6.73 96.14,11.68 95.95,11.88 SW2.2 87.25,11.5 87.25,9.52 86.87,9.14 v2(83.06,9.14) 79.37,9.14 79.37,7.8 C4.2 ; v2(5.21,29.59) 5.21,31.88 5.46,32.13 6.98,32.13 7,32.12 U3.3
  Bottom Layer w0.254: v2(83.06,9.14) 83.06,1.78 82.8,1.52 7.11,1.52 6.35,2.29 6.35,4.19 4.32,6.22 2.16,6.22 2.16,29.59 v2(5.21,29.59)
F_CS: length 43.6
  Top Layer w0.254: v2(32.26,23.11) 29.18,23.11 U3.29 ; H1.4 35.05,1.91 34.8,1.65 25.65,1.65 25.4,1.91 25.4,6.48 26.42,7.49 26.42,9.4 v2(30.23,9.4) U5.1
  Bottom Layer w0.254: v2(30.23,9.4) 32,9.4 32.26,9.65 v2(32.26,23.11)
F_MISO: length 36.9
  Top Layer w0.254: v2(31.37,25.65) 29.18,25.65 U3.31 ; v2(30.23,8.07) 30.28,8.13 U5.2
  Bottom Layer w0.254: v2(31.37,25.65) 31.37,10.29 31.24,10.16 29.46,10.16 29.34,10.03 29.34,8.13 30.17,8.13 v2(30.23,8.07) 30.23,4.83 30.48,4.57 36.96,4.57 37.59,3.94 H1.5
F_MOSI: length 50.6
  Top Layer w0.203: U3.37 30.87,33.39 v2(30.99,33.27)
  Top Layer w0.254: H1.6 40.51,3.3 41.4,3.3 41.4,5.42 v2(41.53,5.55) 41.49,5.59 U5.5
  Bottom Layer w0.254: v2(30.99,33.27) 35.43,33.27 35.43,29.08 35.05,28.7 33.78,28.7 33.53,28.45 33.53,9.14 33.66,9.02 42.16,9.02 42.16,5.71 42,5.55 v2(41.53,5.55)
F_SCK: length 42.4
  Top Layer w0.254: v2(41.53,6.86) U5.6 37.08,6.86 36.96,6.73 36.96,4.83 36.58,4.44 32.77,4.44 32.51,4.19 H1.3 ; U3.30 32.75,24.5 v2(32.77,24.51)
  Bottom Layer w0.254: v2(32.77,24.51) 33.15,24.51 33.15,7.24 33.53,6.86 v2(41.53,6.86)
GPIO0: length 134.9
  Top Layer w0.254: Q2.3 105.9,10.56 106.93,9.52 106.93,6.48 106.05,5.59 73.53,5.59 72.77,6.35 72.77,7.59 ; 72.77,7.59 72.77,11.52 72.49,11.8 ; 72.77,7.59 72.73,7.63 64.11,7.63 63.75,7.27 63.75,1.78 62.99,1.02 25.15,1.02 24.38,1.78 24.38,7.86 C8.2 24.52,9.16 25.91,10.54 31.11,10.54 31.34,10.77 SW3.2 34.54,12.06 34.67,12.19 34.67,19.05 31.75,19.05 30.85,18.15 U3.25
LED_BLUE: length 11.3
  Top Layer w0.254: U3.23 24.51,14.99 24.89,14.6 33.97,14.6 R9.1
LED_GREEN: length 12.1
  Top Layer w0.254: 25.78,16.65 25.78,15.24 25.91,15.11 30.86,15.11 31.5,15.75 31.5,17.91 31.75,18.16 R8.1
LED_RED: length 6.2
  Top Layer w0.254: U3.26 31.37,19.42 32,20.05 32,21.08 32.13,21.21 R7.1
RTS: length 22.3
  Top Layer w0.254: U1.24 101.61,15.88 101.22,15.49 98.3,15.49 98.19,15.38 R3.1 97.93,12.32 96.77,12.32 96.77,7.75 97.15,7.37 102.23,7.37 102.49,7.62 103.84,7.62 Q1.2
RX0: length 185.4
  Top Layer w0.254: U3.34 v2(34.67,29.58) ; v2(102.11,15.37) U1.25
  Bottom Layer w0.254: v2(34.67,29.58) 34.66,29.59 33.02,29.59 33.02,30.37 32.89,30.49 1.66,30.49 1.5,30.33 1.5,5.99 1.93,5.56 4.34,5.56 5.82,4.08 5.82,2.05 6.85,1.02 102.11,1.02 102.49,1.4 102.49,14.6 102.11,14.99 v2(102.11,15.37)
SCL: length 58
  Top Layer w0.254: U3.36 29.08,32.13 31.62,32.13 31.62,39.53 R6.1 32.33,41.66 44.96,41.66 45.92,40.7 P1.3 46.36,36.82 46.36,12.57 45.34,11.56 U4.4
SDA: length 65.5
  Top Layer w0.254: R5.1 37.08,39.92 37.08,38.77 ; 43.18,38.73 v2(43.18,39.37) ; 43.18,38.73 43.38,38.54 P1.4 ; 43.18,38.73 37.12,38.73 37.08,38.77 ; 37.08,38.77 37.08,35.81 35.43,34.16 35.43,28.7 35.04,28.31 U3.33 ; v2(47.12,39.37) 47.12,10.16 U4.6
  Bottom Layer w0.254: v2(43.18,39.37) v2(47.12,39.37)
TX0: length 184.7
  Top Layer w0.254: 29.07,30.85 v2(33.66,30.85) ; U1.26 102.61,16.9 102.87,16.64 v2(102.87,15.49)
  Bottom Layer w0.254: v2(102.87,15.49) 103,15.37 103,1.02 102.49,0.51 6.86,0.51 5.46,1.91 5.46,3.94 4.19,5.21 1.78,5.21 1.14,5.84 1.14,30.48 1.51,30.85 v2(33.66,30.85)
VBUCK: length 73.1
  Top Layer w0.508: L1.2 80.9,30.35 78.87,32.38 78.87,35.54 78.89,35.56 R11.3 81.15,35.69 81.15,36.45 82.3,37.59 83.96,37.59 ; C10.1 93.91,35.56 96.77,35.56 97.03,35.81 97.03,37.62 ; C11.1 83.95,40.51 83.95,37.6 83.96,37.59 ; 97.03,37.62 97,37.59 83.96,37.59 ; 97.03,37.62 97.03,40 112.52,40 113.28,39.24 113.28,37.59 114.17,36.7 115.7,36.7 116.59,35.81 116.59,34.16 116.71,34.04 117.09,34.04 117.86,33.27 117.86,32.26 116.71,31.11 114.52,31.11 SW4.1
VREG: length 35.9
  Top Layer w0.508: SW4.2 113.02,32.25 112.78,32 112.78,31.24 112.65,31.11 99.19,31.11 97.79,29.72 97.79,20.45 96.94,19.6 95.14,19.6 ; C1.2 94.49,16.78 94.49,18.67 95.14,19.32 95.14,19.6 ; 95.14,21.74 95.14,19.6
$1N895: length 20.9
  Top Layer w0.254: USBC1.A5 113.68,19.7 113.92,19.94 113.92,26.03 113.28,26.67 110.36,26.67 109.86,27.18 109.86,29.46 109.6,29.72 105.68,29.72 105.43,29.46 R2.2
$1N1043: length 11.6
  Top Layer w0.254: R1.2 108.08,27.94 107.95,27.81 106.93,27.81 106.81,27.69 106.81,22.86 106.96,22.7 USBC1.B5
$1N2304: length 8.6
  Top Layer w0.254: R4.2 98.15,8.4 98.55,8 101.22,8 101.6,8.38 101.6,9.14 102.04,9.59 Q1.1
$1N2344: length 4.5
  Top Layer w0.254: R3.2 100.84,12.57 102.68,14.41 Q2.1
$1N5171: length 2
  Top Layer w0.254: LED1.2 37.28,21.21 R7.2
$1N5209: length 2.1
  Top Layer w0.254: LED2.1 37.3,18.16 R8.2
$1N5283: length 2
  Top Layer w0.254: R9.2 LED3.2
$1N6381: length 39.9
  Top Layer w0.508: L1.1 v2(80.9,14.86) ; D4.1 68.55,19.46 66.67,21.34 64.77,21.34 64.24,21.87 ; v2(62.36,21.97) 64.14,21.97 64.24,21.87 ; 64.24,21.87 U7.2
  Bottom Layer w0.508: v2(62.36,21.97) 62.36,15.37 62.86,14.86 v2(80.9,14.86)
$1N7006: length 51.6
  Top Layer w0.508: U8.2 62.36,20.07 62.74,20.45 65.15,20.45 65.4,20.19 R12.2 66.82,18.91 66.93,18.8 66.93,15.75 67.44,15.24 70.23,15.24 70.61,15.62 70.61,20.45 69.34,20.45 67.64,22.15 U7.4 67.69,25.08 67.69,28.45 68.07,28.83 73.15,28.83 73.15,37.08 74.17,38.1 R11.2 79.11,38.72 C11.2

## Copper pours and planes (outline as drawn; the poured copper is in the pictures)
GND on Top Layer: 2.29,41.61 10.03,41.61 10.03,36.7 10.29,36.45 29.84,36.45 29.97,36.58 29.97,41.66 116.84,41.66 117.98,40.52 117.98,38.74 118.35,38.37 118.35,1.89 116.97,0.51 115.32,0.25 2.54,0.25 2.16,0.63 1.78,0.63 0.51,2.16 0.51,40.51 1.52,41.53 2.16,41.53 2.29,41.66
GND on Bottom Layer: 2.29,41.61 10.04,41.61 10.04,36.7 10.29,36.45 29.85,36.45 29.98,36.58 29.98,41.66 116.85,41.66 117.98,40.52 117.98,38.74 118.36,38.37 118.36,1.89 116.97,0.51 115.32,0.25 2.55,0.25 2.16,0.63 1.78,0.63 0.51,2.16 0.51,40.51 1.53,41.53 2.16,41.53 2.29,41.66

## Text on the board
Top Silkscreen Layer: SDO | SDI | SCK | 3V3 | 3VO | GND | USER-BUTTON | DATA / DUMP | GREEN | BLUE | RED | CS | DO | DI | SDA | SCL | BOOT | RST | +VBATT - LIPO 14.8 | USB-C | ** | VBUS | VBATT | MSU Flight Computer V1 | MPU-6050 | BMP-280 | Ad Astra
